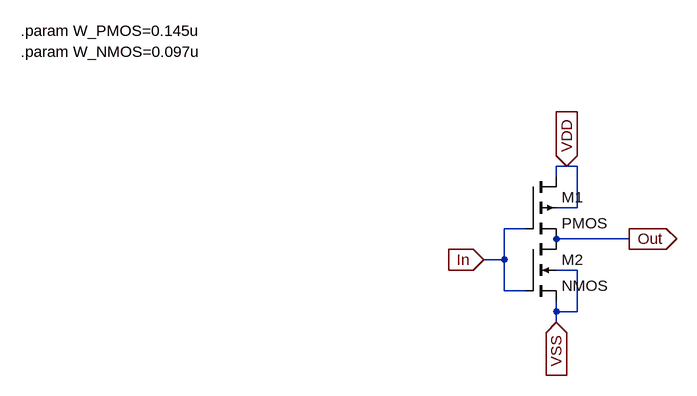
[diagram p0: schematic inverter_sized.asc]
inverter_sized.asc, the LTspice schematic file:
Version 4
SHEET 1 880 680
WIRE 336 240 320 240
WIRE 352 240 336 240
WIRE 320 256 320 240
WIRE 352 304 352 240
WIRE 352 304 320 304
WIRE 272 336 240 336
WIRE 432 352 320 352
WIRE 240 384 240 336
WIRE 240 384 208 384
WIRE 352 400 320 400
WIRE 240 432 240 384
WIRE 272 432 240 432
WIRE 320 464 320 448
WIRE 352 464 352 400
WIRE 352 464 320 464
WIRE 320 480 320 464
FLAG 432 352 Out
IOPIN 432 352 Out
FLAG 208 384 In
IOPIN 208 384 In
FLAG 336 240 VDD
IOPIN 336 240 In
FLAG 320 480 VSS
IOPIN 320 480 In
SYMBOL pmos4 272 256 R0
SYMATTR InstName M1
SYMATTR Value2 l=1e-7 w={W_PMOS}
SYMBOL nmos4 272 352 R0
SYMATTR InstName M2
SYMATTR Value2 l=1e-7 w={W_NMOS}
TEXT -504 32 Left 2 !.param W_PMOS=0.145u
TEXT -504 64 Left 2 !.param W_NMOS=0.097u

The netlist it stands for:
* inverter_sized.asc
M1 VDD In Out VDD PMOS l=1e-7 w={W_PMOS}
M2 Out In VSS VSS NMOS l=1e-7 w={W_NMOS}
.model NMOS NMOS
.model PMOS PMOS
.lib standard.mos
.param W_PMOS=0.145u
.param W_NMOS=0.097u
.backanno
.end